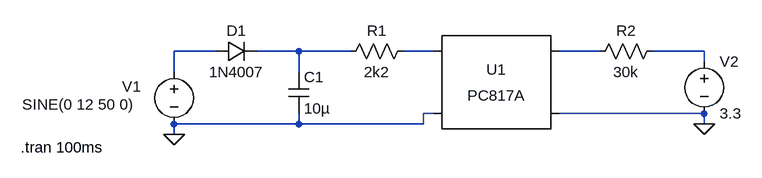
[diagram p0: schematic ESP_Siedle.asc]
ESP_Siedle.asc, the LTspice schematic file:
Version 4
SHEET 1 880 680
WIRE 32 48 -32 48
WIRE 160 48 96 48
WIRE 240 48 160 48
WIRE 368 48 320 48
WIRE 624 48 560 48
WIRE 784 48 704 48
WIRE 784 64 784 48
WIRE -32 80 -32 48
WIRE 160 80 160 48
WIRE 368 144 352 144
WIRE 784 144 560 144
WIRE 160 160 160 144
WIRE 160 160 -32 160
WIRE 352 160 352 144
WIRE 352 160 160 160
WIRE 784 160 784 144
WIRE -32 176 -32 160
FLAG -32 176 0
FLAG 784 160 0
SYMBOL voltage -32 64 R0
WINDOW 0 -80 38 Left 2
WINDOW 3 -234 66 Left 2
WINDOW 123 0 0 Left 0
WINDOW 39 0 0 Left 0
SYMATTR InstName V1
SYMATTR Value SINE(0 12 50 0)
SYMBOL diode 32 64 R270
WINDOW 0 32 32 VTop 2
WINDOW 3 0 32 VBottom 2
SYMATTR InstName D1
SYMATTR Value 1N4007
SYMBOL cap 144 80 R0
SYMATTR InstName C1
SYMATTR Value 10µ
SYMBOL res 336 32 R90
WINDOW 0 0 56 VBottom 2
WINDOW 3 32 56 VTop 2
SYMATTR InstName R1
SYMATTR Value 2k2
SYMBOL Optos\\PC817A 464 96 R0
SYMATTR InstName U1
SYMBOL res 720 32 R90
WINDOW 0 0 56 VBottom 2
WINDOW 3 32 56 VTop 2
SYMATTR InstName R2
SYMATTR Value 30k
SYMBOL voltage 784 48 R0
WINDOW 123 0 0 Left 0
WINDOW 39 0 0 Left 0
SYMATTR InstName V2
SYMATTR Value 3.3
TEXT -268 196 Left 2 !.tran 100ms

The netlist it stands for:
* ESP_Siedle.asc
V1 N001 0 SINE(0 12 50 0)
D1 N001 N002 1N4007
C1 N002 0 10µ
R1 N003 N002 2k2
XU1 N003 0 N004 0 PC817 Igain=1m
R2 N005 N004 30k
V2 N005 0 3.3
.model D D
.lib standard.dio
.tran 100ms
.lib PC817.sub
.backanno
.end